# EAGLE schematic hurf1_board (EAGLE 8.2.2)
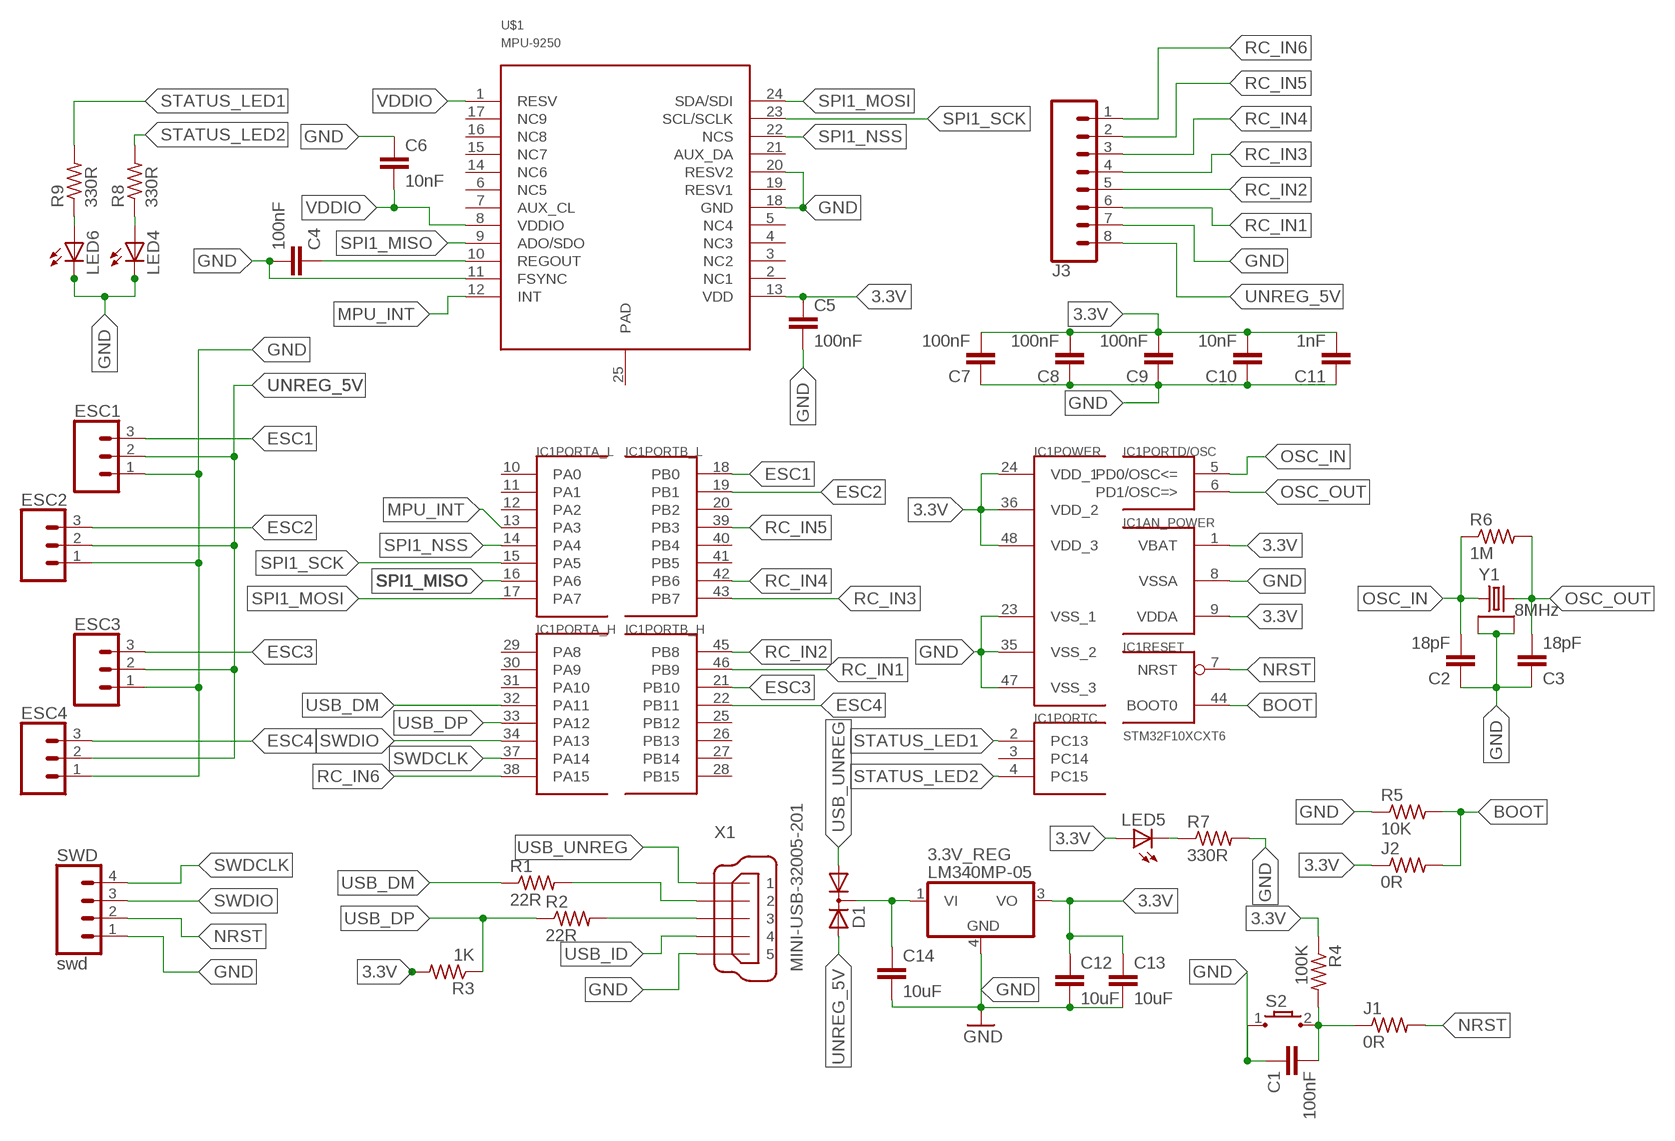
[diagram p0: schematic, sheet 1]

## Parts
3.3V_REG  LM340MP-05  [SOT223]
C1  100nF  C-EUC0603  [C0603]
C2  18pF  C-EUC0603  [C0603]
C3  18pF  C-EUC0603  [C0603]
C4  100nF  C-EUC0805K  [C0805K]
C5  100nF  C-EUC0603  [C0603]
C6  10nF  C-EUC0603  [C0603]
C7  100nF  C-EUC0603  [C0603]
C8  100nF  C-EUC0603  [C0603]
C9  100nF  C-EUC0603  [C0603]
C10  10nF  C-EUC0603  [C0603]
C11  1nF  C-EUC0603  [C0603]
C12  10uF  C-EUC0805  [C0805]
C13  10uF  C-EUC0805  [C0805]
C14  10uF  C-EUC0805  [C0805]
D1  DIODE-2AC|CASOT23  [SOT23]
ESC1  CONN_03  [1X03]
ESC2  CONN_03  [1X03]
ESC3  CONN_03  [1X03]
ESC4  CONN_03  [1X03]
IC1  STM32F10XCXT6  [TQFP48]
J1  0R  R-US_R0603  [R0603]
J2  0R  R-US_R0603  [R0603]
J3  CONN_08  [1X08_1MM_RA]
LED4  LEDSML0805  [SML0805]
LED5  LEDSML0805  [SML0805]
LED6  LEDSML0805  [SML0805]
R1  22R  R-US_R0603  [R0603]
R2  22R  R-US_R0603  [R0603]
R3  1K  R-US_R0603  [R0603]
R4  100K  R-US_R0603  [R0603]
R5  10K  R-US_R0603  [R0603]
R6  1M  R-US_R0603  [R0603]
R7  330R  R-US_R0603  [R0603]
R8  330R  R-US_R0603  [R0603]
R9  330R  R-US_R0603  [R0603]
S2  TL3302-G  [TL3302_GULL_WING]
SWD  swd  CONN_04SMD2  [1X04_1MM_RA]
U$1  MPU-9250  [LEAD-QFN24]
X1  MINI-USB-32005-201  [32005-201]
Y1  8MHz  GSX-531  [GSX-531]

## Nets
3.3V: 3.3V_REG.3(VO) C5.1 C7.2 C8.2 C9.2 C10.2 C11.2 C12.1 C13.1 IC1.1(AN_POWER:VBAT) IC1.9(AN_POWER:VDDA) IC1.24(POWER:VDD_1) IC1.36(POWER:VDD_2) IC1.48(POWER:VDD_3) J2.1 LED5.A R3.2 R4.1 U$1.13(VDD)
BOOT: IC1.44(RESET:BOOT0) J2.2 R5.2
ESC1: ESC1.3 IC1.18(PORTB_L:PB0)
ESC2: ESC2.3 IC1.19(PORTB_L:PB1)
ESC3: ESC3.3 IC1.21(PORTB_H:PB10)
ESC4: ESC4.3 IC1.22(PORTB_H:PB11)
GND: 3.3V_REG.4(GND) C1.1 C2.1 C3.1 C4.2 C5.2 C6.1 C7.1 C8.1 C9.1 C10.1 C11.1 C12.2 C13.2 C14.2 ESC1.1 ESC2.1 ESC3.1 ESC4.1 IC1.8(AN_POWER:VSSA) IC1.23(POWER:VSS_1) IC1.35(POWER:VSS_2) IC1.47(POWER:VSS_3) J3.7 LED4.C LED6.C R5.1 R7.2 S2.1 SWD.1 U$1.11(FSYNC) U$1.18(GND) U$1.20(RESV2) X1.5 Y1.2 Y1.4
MPU_INT: IC1.13(PORTA_L:PA3) U$1.12(INT)
N$1: R1.2 X1.2
N$2: R2.2 X1.3
N$3: C4.1 U$1.10(REGOUT)
N$4: 3.3V_REG.1(VI) C14.1 D1.3(C)
N$5: C1.2 J1.1 R4.2 S2.2
N$6: LED6.A R9.1
N$7: LED5.C R7.1
N$8: LED4.A R8.1
NRST: IC1.7(RESET:NRST) J1.2 SWD.2
OSC_IN: C2.2 IC1.5(PORTD/OSC:PD0/OSC<=) R6.1 Y1.1
OSC_OUT: C3.2 IC1.6(PORTD/OSC:PD1/OSC=>) R6.2 Y1.3
RC_IN1: IC1.46(PORTB_H:PB9) J3.6
RC_IN2: IC1.45(PORTB_H:PB8) J3.5
RC_IN3: IC1.43(PORTB_L:PB7) J3.4
RC_IN4: IC1.42(PORTB_L:PB6) J3.3
RC_IN5: IC1.39(PORTB_L:PB3) J3.2
RC_IN6: IC1.38(PORTA_H:PA15) J3.1
SPI1_MISO: IC1.16(PORTA_L:PA6) U$1.9(ADO/SDO)
SPI1_MOSI: IC1.17(PORTA_L:PA7) U$1.24(SDA/SDI)
SPI1_NSS: IC1.14(PORTA_L:PA4) U$1.22(NCS)
SPI1_SCK: IC1.15(PORTA_L:PA5) U$1.23(SCL/SCLK)
STATUS_LED1: IC1.2(PORTC:PC13) R9.2
STATUS_LED2: IC1.4(PORTC:PC15) R8.2
SWDCLK: IC1.37(PORTA_H:PA14) SWD.4
SWDIO: IC1.34(PORTA_H:PA13) SWD.3
UNREG_5V: D1.2(A2) ESC1.2 ESC2.2 ESC3.2 ESC4.2 J3.8
USB_DM: IC1.32(PORTA_H:PA11) R1.1
USB_DP: IC1.33(PORTA_H:PA12) R2.1 R3.1
USB_ID: X1.4
USB_UNREG: D1.1(A1) X1.1
VDDIO: C6.2 U$1.1(RESV) U$1.8(VDDIO)
Unconnected: IC1.3(PORTC:PC14) IC1.10(PORTA_L:PA0) IC1.11(PORTA_L:PA1) IC1.12(PORTA_L:PA2) IC1.20(PORTB_L:PB2) IC1.25(PORTB_H:PB12) IC1.26(PORTB_H:PB13) IC1.27(PORTB_H:PB14) IC1.28(PORTB_H:PB15) IC1.29(PORTA_H:PA8) IC1.30(PORTA_H:PA9) IC1.31(PORTA_H:PA10) IC1.40(PORTB_L:PB4) IC1.41(PORTB_L:PB5) U$1.2(NC1) U$1.3(NC2) U$1.4(NC3) U$1.5(NC4) U$1.6(NC5) U$1.7(AUX_CL) U$1.14(NC6) U$1.15(NC7) U$1.16(NC8) U$1.17(NC9) U$1.19(RESV1) U$1.21(AUX_DA) U$1.25(PAD)

## Library data of the parts
3.3V_REG = linear:LM340?-*: Positive VOLTAGE REGULATOR Source: http://cache.national.com/ds/LM/LM340.pdf
C1-C3 C5-C14 = rcl:C-EU: CAPACITOR, European symbol
C4 = resistor:C-EU: CAPACITOR, European symbol
D1 = diode:DIODE-2AC|CA: Dual DIODE Anode-Cathode|Cathode-Anode
ESC1-ESC4 = SparkFun-Connectors:CONN_03: Multi connection point. Often used as Generic Header-pin footprint for 0.1 inch spaced/style header connections On any of the 0.1 inch spaced packages, you can populate with these: Break Away Headers - Straight <https://www.sparkfun.com/products/116> (PRT-00116) Break Away Male Headers - Right Angle <https://www.sparkfun.com/products/553> (PRT-00553) Female Headers <https://www.sparkfun.com/products/115> (PRT-00115) Break Away Headers - Machine Pin <https://www.sparkfun.com/products/117> (PRT-00117) Break Away Female Headers - Swiss Machine Pin <https://www.sparkfun.com/products/743> (PRT-00743) Stackable Header - 3 Pin (Female, 0.1") <https://www.sparkfun.com/products/13875> (PRT-13875) For SCREWTERMINALS and SPRING TERMINALS visit here: Screw Terimnals on SparkFun.com <https://www.sparkfun.com/search/results?term=Screw+Terminals> (5mm/3.5mm/2.54mm spacing) This device is also useful as a general connection point to wire up your design to another part of your project. Our various solder wires solder well into these plated through hole pads. Hook-Up Wire - Assortment (Stranded, 22 AWG) <https://www.sparkfun.com/products/11375> (PRT-11375) Hook-Up Wire - Assortment (Solid Core, 22 AWG) <https://www.sparkfun.com/products/11367> (PRT-11367) View the entire wire category on our website here <https://www.sparkfun.com/categories/141> Special notes: Molex polarized connector foot print use with SKU : PRT-08232 with associated crimp pins and housings.
IC1 = stm32:STM32F10XCXT6: ST STM32F101/103 48pin LQFP
J1 J2 R1-R9 = rcl:R-US_: RESISTOR, American symbol
J3 = SparkFun-Connectors:CONN_08: Multi connection point. Often used as Generic Header-pin footprint for 0.1 inch spaced/style header connections On any of the 0.1 inch spaced packages, you can populate with these: Break Away Headers - Straight <https://www.sparkfun.com/products/116> (PRT-00116) Break Away Male Headers - Right Angle <https://www.sparkfun.com/products/553> (PRT-00553) Female Headers <https://www.sparkfun.com/products/115> (PRT-00115) Break Away Headers - Machine Pin <https://www.sparkfun.com/products/117> (PRT-00117) Break Away Female Headers - Swiss Machine Pin <https://www.sparkfun.com/products/743> (PRT-00743) Arduino Stackable Header - 8 Pin <https://www.sparkfun.com/products/9279> (PRT-09279) For SCREWTERMINALS and SPRING TERMINALS visit here: Screw Terimnals on SparkFun.com <https://www.sparkfun.com/search/results?term=Screw+Terminals> (5mm/3.5mm/2.54mm spacing) This device is also useful as a general connection point to wire up your design to another part of your project. Our various solder wires solder well into these plated through hole pads. Hook-Up Wire - Assortment (Stranded, 22 AWG) <https://www.sparkfun.com/products/11375> (PRT-11375) Hook-Up Wire - Assortment (Solid Core, 22 AWG) <https://www.sparkfun.com/products/11367> (PRT-11367) View the entire wire category on our website here <https://www.sparkfun.com/categories/141> Special notes: Molex polarized connector foot print use with SKU : PRT-08231 with associated crimp pins and housings. 1MM SMD Version SKU: PRT-10208 NOTES ON THE VARIANTS LOCK and LOCK_LONGPADS... This footprint was designed to help hold the alignment of a through-hole component (i.e. 6-pin header) while soldering it into place. You may notice that each hole has been shifted either up or down by 0.005 of an inch from it's more standard position (which is a perfectly straight line). This slight alteration caused the pins (the squares in the middle) to touch the edges of the holes. Because they are alternating, it causes a "brace" to hold the component in place. 0.005 has proven to be the perfect amount of "off-center" position when using our standard breakaway headers. Although looks a little odd when you look at the bare footprint, once you have a header in there, the alteration is very hard to notice. Also,if you push a header all the way into place, it is covered up entirely on the bottom side.
LED4-LED6 = led:LED: LED OSRAM: - CHIPLED LG R971, LG N971, LY N971, LG Q971, LY Q971, LO R971, LY R971 LH N974, LH R974 LS Q976, LO Q976, LY Q976 LO Q996 - Hyper CHIPLED LW Q18S LB Q993, LB Q99A, LB R99A - SideLED LS A670, LO A670, LY A670, LG A670, LP A670 LB A673, LV A673, LT A673, LW A673 LH A674 LY A675 LS A676, LA A676, LO A676, LY A676, LW A676 LS A679, LY A679, LG A679 - Hyper Micro SIDELED® LS Y876, LA Y876, LO Y876, LY Y876 LT Y87S - SmartLED LW L88C, LW L88S LB L89C, LB L89S, LG L890 LS L89K, LO L89K, LY L89K LS L896, LA L896, LO L896, LY L896 - TOPLED LS T670, LO T670, LY T670, LG T670, LP T670 LSG T670, LSP T670, LSY T670, LOP T670, LYG T670 LG T671, LOG T671, LSG T671 LB T673, LV T673, LT T673, LW T673 LH T674 LS T676, LA T676, LO T676, LY T676, LB T676, LH T676, LSB T676, LW T676 LB T67C, LV T67C, LT T67C, LS T67K, LO T67K, LY T67K, LW E67C LS E67B, LA E67B, LO E67B, LY E67B, LB E67C, LV E67C, LT E67C LW T67C LS T679, LY T679, LG T679 LS T770, LO T770, LY T770, LG T770, LP T770 LB T773, LV T773, LT T773, LW T773 LH T774 LS E675, LA E675, LY E675, LS T675 LS T776, LA T776, LO T776, LY T776, LB T776 LHGB T686 LT T68C, LB T68C - Hyper Mini TOPLED® LB M676 - Mini TOPLED Santana® LG M470 LS M47K, LO M47K, LY M47K Source: http://www.osram.convergy.de LUXEON: - LUMILED® LXK2-PW12-R00, LXK2-PW12-S00, LXK2-PW14-U00, LXK2-PW14-V00 LXK2-PM12-R00, LXK2-PM12-S00, LXK2-PM14-U00 LXK2-PE12-Q00, LXK2-PE12-R00, LXK2-PE12-S00, LXK2-PE14-T00, LXK2-PE14-U00 LXK2-PB12-K00, LXK2-PB12-L00, LXK2-PB12-M00, LXK2-PB14-N00, LXK2-PB14-P00, LXK2-PB14-Q00 LXK2-PR12-L00, LXK2-PR12-M00, LXK2-PR14-Q00, LXK2-PR14-R00 LXK2-PD12-Q00, LXK2-PD12-R00, LXK2-PD12-S00 LXK2-PH12-R00, LXK2-PH12-S00 LXK2-PL12-P00, LXK2-PL12-Q00, LXK2-PL12-R00 Source: www.luxeon.com KINGBRIGHT: KA-3528ASYC Source: www.kingbright.com
S2 = eswitch-tact:TL3302: E-Switch TL3302 Series Tactile Switch Surface mount button commonly used for reset or general input. 3.5 x 6mm packaged design. -G: Gull wing termination. Parts TL-3302-x-xxxx-x-G -J: J-Lead termination. Parts TL-3302-x-xxxx-x-J Source: http://www.e-switch.com/Portals/0/Series_Pdf/TL3302.pdf Supplier: DigiKey: http://be.digikey.com/scripts/dksearch/dksus.dll?vendor=0&keywords=TL3302
SWD = SparkFun-Connectors:CONN_04: Multi connection point. Often used as Generic Header-pin footprint for 0.1 inch spaced/style header connections On any of the 0.1 inch spaced packages, you can populate with these: Break Away Headers - Straight <https://www.sparkfun.com/products/116> (PRT-00116) Break Away Male Headers - Right Angle <https://www.sparkfun.com/products/553> (PRT-00553) Female Headers <https://www.sparkfun.com/products/115> (PRT-00115) Break Away Headers - Machine Pin <https://www.sparkfun.com/products/117> (PRT-00117) Break Away Female Headers - Swiss Machine Pin <https://www.sparkfun.com/products/743> (PRT-00743) For SCREWTERMINALS and SPRING TERMINALS visit here: Screw Terimnals on SparkFun.com <https://www.sparkfun.com/search/results?term=Screw+Terminals> (5mm/3.5mm/2.54mm spacing) This device is also useful as a general connection point to wire up your design to another part of your project. Our various solder wires solder well into these plated through hole pads. Hook-Up Wire - Assortment (Stranded, 22 AWG) <https://www.sparkfun.com/products/11375> (PRT-11375) Hook-Up Wire - Assortment (Solid Core, 22 AWG) <https://www.sparkfun.com/products/11367> (PRT-11367) View the entire wire category on our website here <https://www.sparkfun.com/categories/141> Special notes: Molex polarized connector foot print use with SKU : PRT-08231 with associated crimp pins and housings. 1MM SMD Version SKU: PRT-10208; PROD_ID: CONN-10310; SF_ID: PRT-10208
U$1 = invensense:MPU-9250
X1 = con-cypressindustries:MINI-USB-: MINI USB-B Conector Source: www.cypressindustries.com; OC_FARNELL: unknown; OC_NEWARK: unknown
Y1 = Golledge:GSX-531: Crystal |SM| 5.0 x 3.2 mm | AT cut | Frequency Range 8 - 100 MHz Metal lid can be grounded to minimise EMI Seam seal for excellent long-term stability Tight specifications available Ultra-miniature for maximum space saving Datasheet <http://www.golledge.com/docs/products/xtl_sm/gsx531.htm?src=eagle>; HEIGHT: 0.9